# EAGLE design Espress0 (EAGLE 9.1.1)
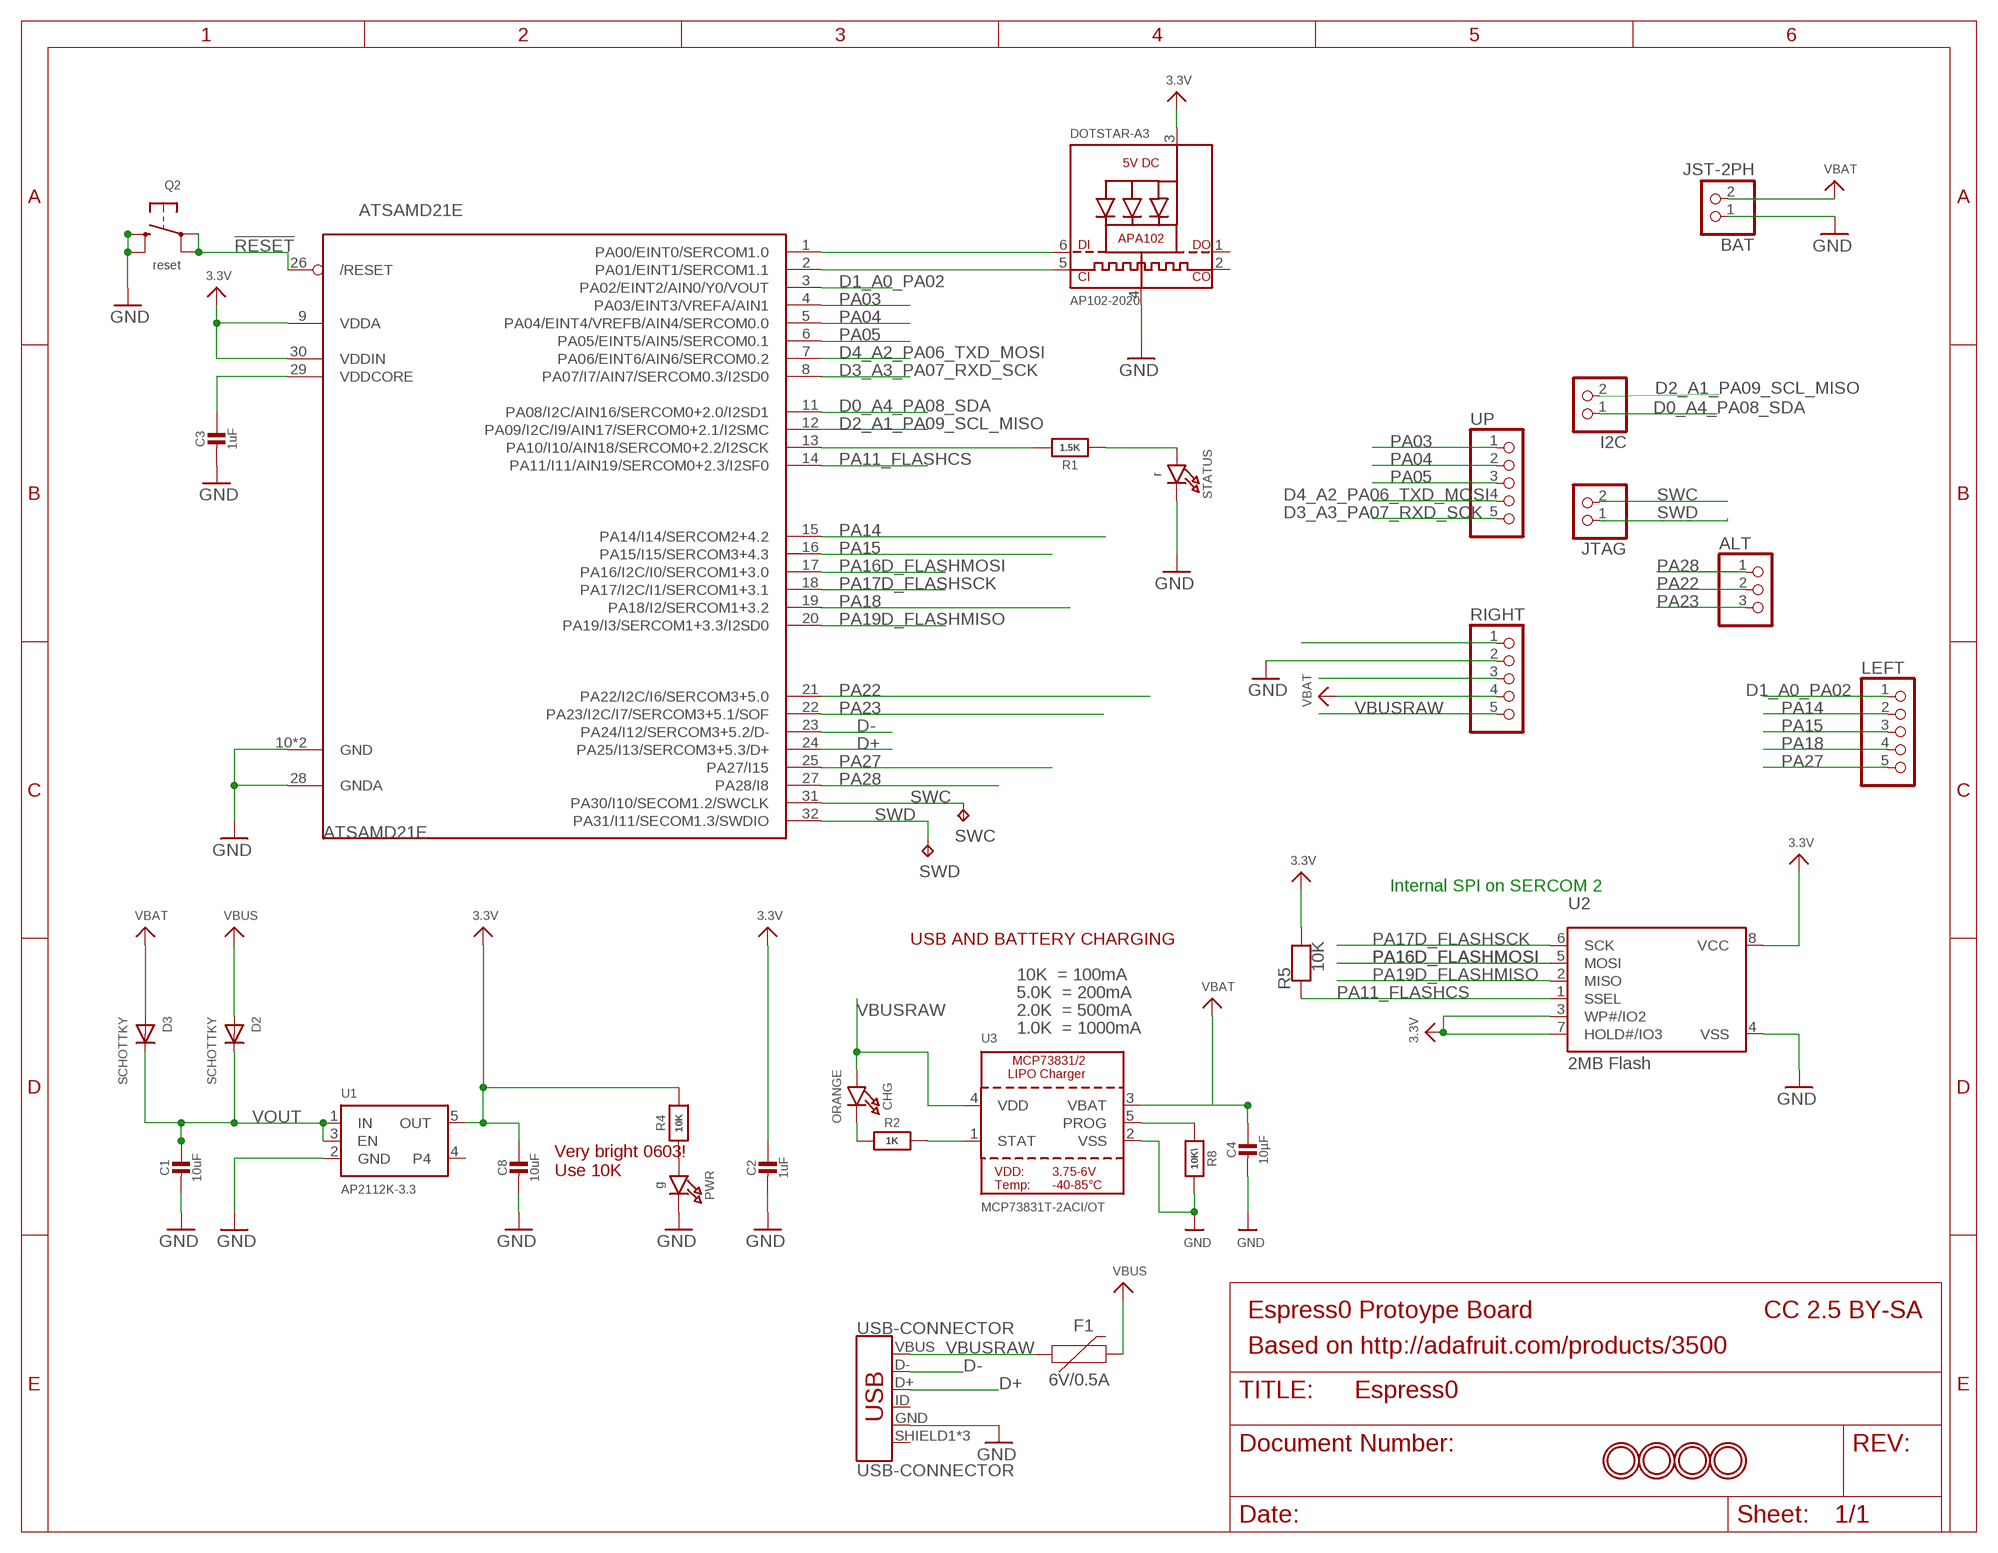
[diagram p0: schematic, sheet 1]

## Parts
ALT  PINHD-1X3CB  [1X03-CLEANBIG]
ATSAMD21E  ATSAMD21E  [QFN32_5MM]
BAT  JST-2PH  CON_JST_PH_2PIN  [JSTPH2]
C1  10uF  CAP_CERAMIC0805-NOOUTLINE  [0805-NO]
C2  1uF  CAP_CERAMIC0603_NO  [0603-NO]
C3  1uF  CAP_CERAMIC0603_NO  [0603-NO]
C4  10µF  CAP_CERAMIC0805-NOOUTLINE  [0805-NO]
C8  10uF  CAP_CERAMIC0805-NOOUTLINE  [0805-NO]
CHG  ORANGE  LED0805_NOOUTLINE  [CHIPLED_0805_NOOUTLINE]
D2  SCHOTTKY  DIODE_SOD-123FL  [SOD-123FL]
D3  SCHOTTKY  DIODE_SOD-123FL  [SOD-123FL]
DOTSTAR-A3  AP102-2020  APA1022020  [APA102_2020]
F1  6V/0.5A  PPTC_HALF-AMP  [1206]
I2C  HEADER-1X2ROUND  [1X02_ROUND]
JTAG  HEADER-1X2ROUND  [1X02_ROUND]
LEFT  HEADER-1X576MIL  [1X05_ROUND_76]
PWR  g  LED0603_NOOUTLINE  [CHIPLED_0603_NOOUTLINE]
Q2  reset  SWITCH_TACT_SMT4.6X2.8  [BTN_KMR2_4.6X2.8]
R1  1.5K  RESISTOR_0603_NOOUT  [0603-NO]
R2  1K  RESISTOR_0603_NOOUT  [0603-NO]
R4  10K  RESISTOR_0603_NOOUT  [0603-NO]
R5  10K  RESISTOR_0603_NOOUT  [0603-NO]
R8  10K\  RESISTOR_0603_NOOUT  [0603-NO]
RIGHT  HEADER-1X576MIL  [1X05_ROUND_76]
STATUS  r  LED0603_NOOUTLINE  [CHIPLED_0603_NOOUTLINE]
SWC  TPB1,27  [B1,27]
SWD  TPB1,27  [B1,27]
U1  AP2112K-3.3  VREG_SOT23-5  [SOT23-5]
U2  2MB Flash  SPIFLASH_SOIC8208MIL  [SOIC8_208MIL]
U3  MCP73831T-2ACI/OT  MCP73831/2  [SOT23-5]
U$8  MOUNTINGHOLE2.0  [MOUNTINGHOLE_2.0_PLATED]
U$9  MOUNTINGHOLE2.0  [MOUNTINGHOLE_2.0_PLATED]
U$13  MOUNTINGHOLE2.0  [MOUNTINGHOLE_2.0_PLATED]
U$14  MOUNTINGHOLE2.0  [MOUNTINGHOLE_2.0_PLATED]
UP  HEADER-1X576MIL  [1X05_ROUND_76]
USB-CONNECTOR  USB-CONNECTOR  USB_MICRO-B_FEMALE-SMT  [USB-B-MICRO-SMD]

## Nets
3.3V: ATSAMD21E.9(VDDA) ATSAMD21E.30(VDDIN) C2.1 C8.1 DOTSTAR-A3.3(VDD) R4.2 R5.2 RIGHT.3 U1.5(OUT) U2.3(WP#/IO2) U2.7(HOLD#/IO3) U2.8(VCC)
!RESET: ATSAMD21E.26(/RESET) Q2.A'(P1) Q2.A(P) RIGHT.1
A3: ATSAMD21E.1(PA00/EINT0/SERCOM1.0) DOTSTAR-A3.6(DI)
D0_A4_PA08_SDA: ATSAMD21E.11(PA08/I2C/AIN16/SERCOM0+2.0/I2SD1) I2C.1
D1_A0_PA02: ATSAMD21E.3(PA02/EINT2/AIN0/Y0/VOUT) LEFT.1
D2_A1_PA09_SCL_MISO: ATSAMD21E.12(PA09/I2C/I9/AIN17/SERCOM0+2.1/I2SMC) I2C.2
D3_A3_PA07_RXD_SCK: ATSAMD21E.8(PA07/I7/AIN7/SERCOM0.3/I2SD0) UP.5
D4_A2_PA06_TXD_MOSI: ATSAMD21E.7(PA06/EINT6/AIN6/SERCOM0.2) UP.4
D+: ATSAMD21E.24(PA25/I13/SERCOM3+5.3/D+) USB-CONNECTOR.D+
D-: ATSAMD21E.23(PA24/I12/SERCOM3+5.2/D-) USB-CONNECTOR.D-
GND: ATSAMD21E.10(GND) ATSAMD21E.28(GNDA) ATSAMD21E.33(GND) BAT.1 C1.2 C2.2 C3.2 C4.2 C8.2 DOTSTAR-A3.4(GND) PWR.C Q2.B'(S1) Q2.B(S) R8.2 RIGHT.2 STATUS.C U1.2(GND) U2.4(VSS) U3.2(VSS) USB-CONNECTOR.GND
N$1: R1.1 STATUS.A
N$2: ATSAMD21E.13(PA10/I10/AIN18/SERCOM0+2.2/I2SCK) R1.2
N$6: PWR.A R4.1
N$8: ATSAMD21E.2(PA01/EINT1/SERCOM1.1) DOTSTAR-A3.5(CKI)
N$11: CHG.C R2.1
N$12: R2.2 U3.1(STAT)
N$13: R8.1 U3.5(PROG)
PA03: ATSAMD21E.4(PA03/EINT3/VREFA/AIN1) UP.1
PA04: ATSAMD21E.5(PA04/EINT4/VREFB/AIN4/SERCOM0.0) UP.2
PA05: ATSAMD21E.6(PA05/EINT5/AIN5/SERCOM0.1) UP.3
PA11_FLASHCS: ATSAMD21E.14(PA11/I11/AIN19/SERCOM0+2.3/I2SF0) R5.1 U2.1(SSEL)
PA14: ATSAMD21E.15(PA14/I14/SERCOM2+4.2) LEFT.2
PA15: ATSAMD21E.16(PA15/I15/SERCOM3+4.3) LEFT.3
PA16D_FLASHMOSI: ATSAMD21E.17(PA16/I2C/I0/SERCOM1+3.0) U2.5(MOSI)
PA17D_FLASHSCK: ATSAMD21E.18(PA17/I2C/I1/SERCOM1+3.1) U2.6(SCK)
PA18: ATSAMD21E.19(PA18/I2/SERCOM1+3.2) LEFT.4
PA19D_FLASHMISO: ATSAMD21E.20(PA19/I3/SERCOM1+3.3/I2SD0) U2.2(MISO)
PA22: ALT.2 ATSAMD21E.21(PA22/I2C/I6/SERCOM3+5.0)
PA23: ALT.3 ATSAMD21E.22(PA23/I2C/I7/SERCOM3+5.1/SOF)
PA27: ATSAMD21E.25(PA27/I15) LEFT.5
PA28: ALT.1 ATSAMD21E.27(PA28/I8)
SWC: ATSAMD21E.31(PA30/I10/SECOM1.2/SWCLK) JTAG.2 SWC.TP
SWD: ATSAMD21E.32(PA31/I11/SECOM1.3/SWDIO) JTAG.1 SWD.TP
VBAT: BAT.2 C4.1 D3.A RIGHT.4 U3.3(VBAT)
VBUS: D2.A F1.2
VBUSRAW: CHG.A F1.1 RIGHT.5 U3.4(VDD) USB-CONNECTOR.VBUS
VDDCORE: ATSAMD21E.29(VDDCORE) C3.1
VOUT: C1.1 D2.C D3.C U1.1(IN) U1.3(EN)
Unconnected: DOTSTAR-A3.1(DO) DOTSTAR-A3.2(CKO) U1.4 USB-CONNECTOR.ID USB-CONNECTOR.SHIELD1(SHIELD) USB-CONNECTOR.SHIELD2(SHIELD) USB-CONNECTOR.SHIELD3(SHIELD)

## Notes on the sheet
- Internal SPI on SERCOM 2
- USB AND BATTERY CHARGING
- 10K  = 100mA
- 5.0K  = 200mA
- 2.0K  = 500mA
- 1.0K  = 1000mA
- Very bright 0603!
  Use 10K
- Espress0 Protoype Board | CC 2.5 BY-SA
- Based on http://adafruit.com/products/3500

## Library data of the parts
ALT = adafruit:PINHD-1X3: PIN HEADER
ATSAMD21E = microbuilder:ATSAMD21E
BAT = microbuilder:CON_JST_PH_2PIN: JST 2-Pin Right-Angle Connector PH-Series - 4UConnector: 17311 SH-Series - 4UConnector: 07278
C1-C4 C8 = microbuilder:CAP_CERAMIC: Ceramic Capacitors For new designs, use the packages preceded by an '_' character since they are more reliable: The following footprints should be used on most boards: _0402 - Standard footprint for regular board layouts _0603 - Standard footprint for regular board layouts _0805 - Standard footprint for regular board layouts _1206 - Standard footprint for regular board layouts For extremely tight-pitch boards where space is at a premium, the following 'micro-pitch' footprints can be used (smaller pads, no silkscreen outline, etc.): _0402MP - Micro-pitch footprint for very dense/compact boards _0603MP - Micro-pitch footprint for very dense/compact boards _0805MP - Micro-pitch footprint for very dense/compact boards _1206MP - Micro-pitch footprint for very dense/compact boards
CHG PWR STATUS = microbuilder:LED: LED 0603 - 0603 Surface Mount Package 2mA: Green LED - Low Power (3.9mcd, 2ma, 1.7Vf) - Digikey: 475-2709-2-ND Orange LED - Low Power (9.8mcd, 2ma, 1.8Vf) - Digikey: 475-1194-2-ND Red LED - Low Power (5mcd, 2ma, 1.8Vf) - Digikey: 475-1195-2-ND Yellow LED - Low Power (7mcd, 2ma, 1.8Vf) - Digikey: 475-1196-2-ND 5mA: Blue LED - Low Power (17mcd, 5ma, 2.9Vf) - Digikey: LNJ937W8CRACT-ND 0805 - 0805 Surface Mount Package 2mA: Red LED (8.8mcd, 2mA, 1.8Vf, Clear) - Low Power [Digikey: 475-2510-1-ND] Green LED (5mcd, 2mA, 1.8Vf, Clear) - Low Power [Digikey: 475-2730-1-ND] Yellow LED (11.3mcd, 2mA, 1.8Vf, Clear) - Low Power [Digikey: 475-2555-1-ND] 20mA: Red LED (104mcd, 20mA, Diffused) - LS R976 [Digikey: 475-1278-6-ND] Red LED (12mcd, 20mA, 2.0Vf, Clear) - APT2012EC [Digikey: 754-1128-1-ND] Green LED (15mcd, 20mA, 2.2Vf, Clear) - APT2012GC [Digikey: 754-1131-1-ND] Orange LED (160mcd, 20mA, 2.1Vf, Clear) - APT2012SECK [Digikey: 754-1130-1-ND] 1206 - 1206 Surface Mount Package Green LED (26mcd, 20mA, Diffused) - LG N971 [Digikey: 475-1407-6-ND] Red LED (15mcd, 20mA, Diffused) - LH N974 [Digikey: 475-1416-6-ND] Cree - Cree High-Power Surface Mount LEDs XPEBWT-L1-0000-00D50 - White 111lm 350mA 2.9Vf 6200K 110° XTEAWT-00-0000-00000LEE3 - White 114lm 350mA 2.85Vf 5000K 115° Everlight - Everlight 45-21 Series Surface Mount LEDs 45-21/QK2C-B2832AC2CB2/2T - Warm White 2000mcd 20mA 3.25Vf 3050K 120° 45-21/LK2C-B38452C4CB2/2T - Nuetral White 2000mcd 20mA 3.25Vf 4150K 120° 45-21/LK2C-B50634C6CB2/2T - Cold White 2200mcd 20mA 3.25Vf 5650K 120° PLCC2 Reverse Mount LS T77K-J1L2-1-0-2-R18-Z - Red 11.25mcd 2mA 1.8Vf 630nm 120° LO T77K-L1M2-24-Z - Orange 19.6mcd 2mA 1.8Vf 606nm 120° LY T77K-K2M1-26-Z - Yellow 15.7mcd 2mA 1.8Vf 587nm 120°
D2 D3 = adafruit:DIODE: Diode SMADIODE - SMA Surface Mount Package 20V 1A Schottky Diode Digikey: 641-1014-6-ND DO-1N4148 - Through Hole Small Current Diode SOD-123 20V 1 A (.5mV Vf) Schottky Diode - Digikey: MBRX120TPMSCT-ND SOD-323 10V 570mA (.38mV Vf, 3ns) Schottky Diode - Digikey: ZLLS410CT-ND SOD-523 30V 30mA Schottky Diode (RB751S-40TE61) - Digikey: RB751S-40TE61CT-ND SOT23-R/W - SOT23 Package (R = Solder Paste/Reflow Ovens, W = Hand-Soldering) BAT54Film 40V 300mA - Digikey: 497-7162-1-ND
DOTSTAR-A3 = microbuilder:APA102: APA102/DotStar Pixels VCC: 5V DC Refresh Rate: 400Hz
F1 = SparkFun-Fuses:PPTC: Resettable Fuse PPTC Resettable Fuse. Really a sort of resistor with a polymeric positive temperature coefficient whose resistance increases dramatically with an increase in temperature. When heated by the power passing through the resistance rises causing the current to be limited, protecting the circuit. This is achieved by the transition of the polymer from a crystalline to an amorphous state where the conductive carbon separates breaking the conductive pathways found in the cool crystalline structure. When a PPTC cools back down it resumes conducting letting the circuit turn back on. SparkFun Products: SparkFun RedBoard - Programmed with Arduino <https://www.sparkfun.com/products/12757> Pro Micro - 5V/16MHz <https://www.sparkfun.com/products/12640> Arduino Pro 328 - 5V/16MHz <https://www.sparkfun.com/products/10915> MP3 Trigger <https://www.sparkfun.com/products/13720>; PROD_ID: RES-08585
I2C JTAG = microbuilder:HEADER-1X2: PIN HEADER
LEFT RIGHT UP = microbuilder:HEADER-1X5: PIN HEADER
Q2 = microbuilder:SWITCH_TACT_SMT: SMT Tact Switches 6x6mm - Digikey: P12940SCT-ND KMR2 (4.6x2.8mm) - Digikey: 401-1426-1-ND EVQ-PQHB55 - Light Touch, 160GF (4.5x4.5mm) - Digikey: P8090SCT-ND KMT0 - KMT021 NGJ LHS (etc.) IP68/Waterproof - Digikey: CKN10289CT-ND
R1 R2 R4 R5 R8 = microbuilder:RESISTOR: Resistors For new designs, use the packages preceded by an '_' character since they are more reliable: The following footprints should be used on most boards: _0402 - Standard footprint for regular board layouts _0603 - Standard footprint for regular board layouts _0805 - Standard footprint for regular board layouts _1206 - Standard footprint for regular board layouts For extremely tight-pitch boards where space is at a premium, the following 'micro-pitch' footprints can be used (smaller pads, no silkscreen outline, etc.): _0402MP - Micro-pitch footprint for very dense/compact boards _0603MP - Micro-pitch footprint for very dense/compact boards _0805MP - Micro-pitch footprint for very dense/compact boards _1206MP - Micro-pitch footprint for very dense/compact boards
SWC SWD = testpad:TP: Test pad
U1 = microbuilder:VREG_SOT23-5: SOT23-5 Fixed Voltage Regulators Part Current Out V Out V In V Dropout θJA (°C/W) TJ (°C) Digikey Part No. ADP121 150mA 3.3V 3.4-5.5V 0.09V @ 150mA -- -- ADP121-AUJZ33R7CT-ND ADP121 150mA 3.0V 3.1-5.5V 0.09V @ 150mA -- -- ADP121-AUJZ30R7CT-ND ADP122 300mA 3.3V 3.4-5.5V 0.085V @ 300mA -- -- ADP122AUJZ-3.3-R7CT-ND ADP1712 300mA 3.3V 3.5-5.5V 0.17V @ 300mA -- -- ADP1712AUJZ-3.3-R7TR-ND AP7311 (Low Cost) 150mA 3.3V 3.5-6V 0.15V @ 150mA -- -- AP7311-33WG-7DICT-ND LD39015M18R 150mA 1.8V 1.9V-5.5V 0.08V @ 100mA -- -- 497-6977-1-ND LP2985A-33DBVR 150mA 3.3V 3.3-16V 0.28V @ 150mA 206 150 296-18479-1-ND MCP1824T-3302E/OT 300mA 3.3V 3.5V-6V 0.2V @ 300mA -- -- MCP1824T-3302E/OTCT-ND MIC5205-2.5YM5 TR 150mA 2.5V 2.7-16V 0.165V @ 150mA -- -- 576-1257-2-ND MIC5205-3.0YM5 TR 150mA 3.0V 3.2V-16V 0.165V @ 150mA -- -- 576-1258-2-ND MIC5205-3.3YM5 TR 150mA 3.3V 3.5V-16V 0.165V @ 150mA -- -- 576-1259-2-ND TPS780330220 150mA 3.3V+2.2V 3.6-5.5V 250mV Max -- -- 296-23332-1-ND TDA3663/N1,135 100mA 3.3V 3.5-45V 0.18V @ 50mA -- -- 568-5343-1-ND Max operating temp can be calculated using θJA, TJ (max junction temperature), and power in watts. Set the "Maximum Ambient Temperature" until it reaches TJ ("Max Junction Temperature"), which is the absolute limit for safe use of the regulator: Heat Sink Temperature Calculator <http://www.daycounter.com/Calculators/Heat-Sink-Temperature-Calculator.phtml> For example, With 12V source into a 3.3V LP2985 and a 30mA load, we are dissipating (12V-3.3V) * 0.03A = 0.261W. With a θJA of 206 °C/W, a TJ of 150°C, and 261mW we can safely use the chip without a heat sink up to 75°C (=147.1°C Junction Temperature).
U2 = microbuilder:SPIFLASH_SOIC8: SOIC8 SPI Flash Be careful with the size since SOIC8 flash comes in several 'widths' SOIC8 150 mil M25P16 - 16Mbit (2Mbit x 8) Serial Flash (75MHz SPI Bus), Supply: 2.7-3.6V Digikey: SOIC8 - M25P16-VMN6P-ND SOIC8 208 mil W25Q16BVSSIG - 16Mbit (2Mbit x 8) Serial Flash (104MHz SPI Bus), Supply: 2.7-3.6V Digikey: SOIC8 - W25Q16BVSSIG-ND
U3 = microbuilder:MCP73831/2: MCP73831/2 LIPO Charger VDD: 3.75 - 6V Temp -40 - 85°C Programmable Charge Rate: 15-500mA NOTE: STAT is a tri-state logic output on the MCP73831 and an open-drain output on the MCP73832. SOT23-5 with 4.2V output and tri-state logic on STAT = MCP73831T-2ACI/OT
U$8 U$9 U$13 U$14 = microbuilder:MOUNTINGHOLE: Mounting Hole For #2 screws (0.086"/2.18mm width, 0.094"/2.4mm hole) use 2.5mm; BOM: EXCLUDE
USB-CONNECTOR = SparkFun-Connectors:USB_MICRO-B: USB Type Micro-B Connector Male/female and PTH/SMT variants SparkFun Products: SparkFun microB USB Breakout <https://www.sparkfun.com/products/12035> SparkFun USB microB Plug Breakout <https://www.sparkfun.com/products/10031> SparkFun ESP8266 Thing <https://www.sparkfun.com/products/13231>; PROD_ID: CONN-11752

## Net classes
1 power: width 0.305 mm

## Board
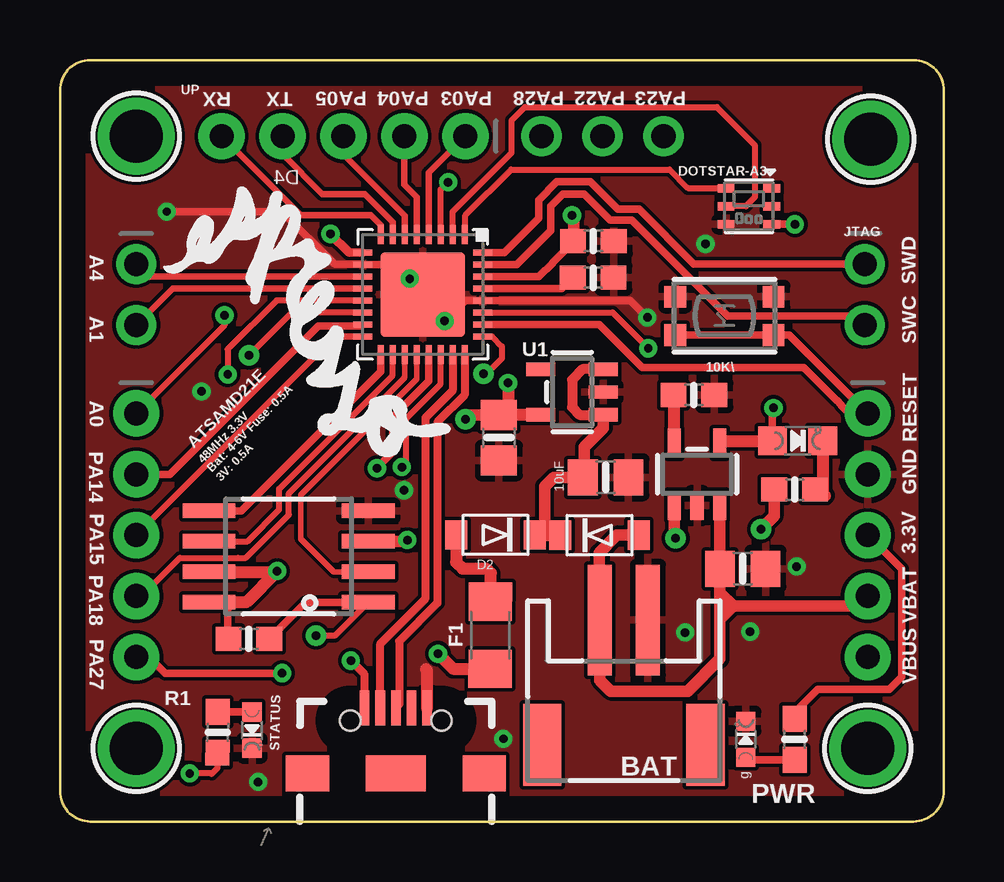
[diagram p1: board, top side]
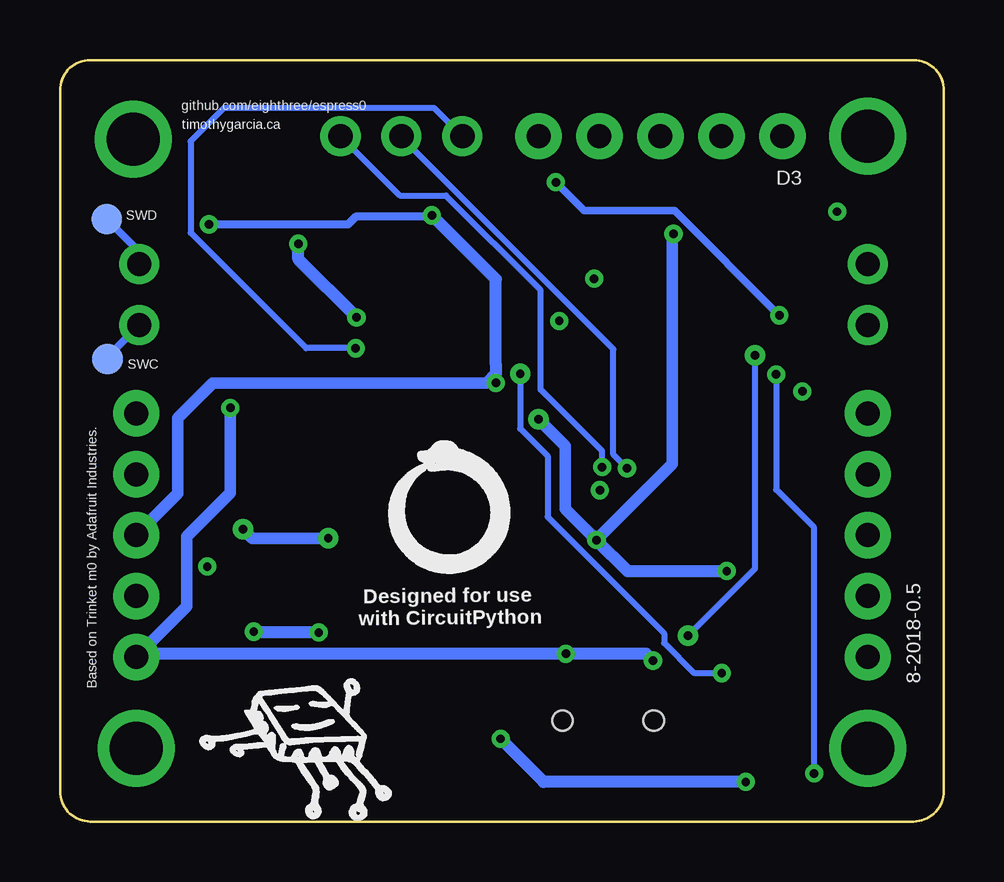
[diagram p2: board, bottom side, seen from below]

Size 36.83 x 31.75 mm. Coordinates in mm from the lower left corner, seen from the top.
Outline: 35.56,0 1.27,0 arc-90 0,1.27 0,30.48 arc-90 1.27,31.75 35.56,31.75 arc-90 36.83,30.48 36.83,1.27 arc-90 35.56,0
Copper layers (1*16): Top 0.035mm / dielectric 1.5mm / Bottom 0.035mm
Design rules "default": minimum track width 6mil, minimum drill 0.35mm, track to track 6mil, track to pad 6mil, pad to pad 6mil, via to via 6mil, smd to smd 6mil, copper to edge 40mil, drill to drill 6mil, minimum pad ring 10mil, minimum via ring 8mil, stop-mask expansion 4mil, vias tented up to drill 0mil, thermal gap 10mil

### Footprints (pad centres in the part's own frame; a part is rotated, then mirrored left to right if it is on the bottom)
1X03-CLEANBIG = drill 1.016 pad 1.676: 1 -2.54,0; 2 0,0; 3 2.54,0
QFN32_5MM = smd 0.8 x 0.25: 1 -2.5,1.75; 2 -2.5,1.25; 3 -2.5,0.75; 4 -2.5,0.25; 5 -2.5,-0.25; 6 -2.5,-0.75; 7 -2.5,-1.25; 8 -2.5,-1.75; 17 2.5,-1.75; 18 2.5,-1.25; 19 2.5,-0.75; 20 2.5,-0.25; 21 2.5,0.25; 22 2.5,0.75; 23 2.5,1.25; 24 2.5,1.75 | smd 0.25 x 0.8: 9 -1.75,-2.5; 10 -1.25,-2.5; 11 -0.75,-2.5; 12 -0.25,-2.5; 13 0.25,-2.5; 14 0.75,-2.5; 15 1.25,-2.5; 16 1.75,-2.5; 25 1.75,2.5; 26 1.25,2.5; 27 0.75,2.5; 28 0.25,2.5; 29 -0.25,2.5; 30 -0.75,2.5; 31 -1.25,2.5; 32 -1.75,2.5 | smd 3.5 x 3.5: 33 0,0
JSTPH2 = smd 1 x 4.6: 1 -1,-3.7; 2 1,-3.7 | smd 1.6 x 3.4: NC1 -3.4,1.5; NC2 3.4,1.5
0805-NO = smd 1.24 x 1.5: 1 -0.95,0; 2 0.95,0
0603-NO = smd 1.075 x 1: 1 -0.85,0; 2 0.85,0
CHIPLED_0805_NOOUTLINE = smd 1.2 x 1.2: A 0,-1.05; C 0,1.05
SOD-123FL = smd 0.91 x 1.22: A 1.637,0; C -1.637,0
APA102_2020 = smd 0.7 x 0.35: 1 -0.95,-0.75; 2 -0.95,0; 3 -0.95,0.75; 4 0.95,0.75; 5 0.95,0; 6 0.95,-0.75
1206 = smd 1.6 x 1.8: 1 -1.4,0; 2 1.4,0
1X02_ROUND = drill 1 pad 1.676: 1 -1.27,0; 2 1.27,0
1X05_ROUND_76 = drill 1 pad 1.93: 1 -5.08,0; 2 -2.54,0; 3 0,0; 4 2.54,0; 5 5.08,0
CHIPLED_0603_NOOUTLINE = smd 0.8 x 0.8: A 0,-0.75; C 0,0.75
BTN_KMR2_4.6X2.8 = smd 0.9 x 0.9: A 2.05,0.8; A' -2.05,0.8; B 2.05,-0.8; B' -2.05,-0.8
B1,27 = smd 1.27 x 1.27: TP 0,0
SOT23-5 = smd 0.55 x 1.2: 1 -0.95,-1.3; 2 0,-1.3; 3 0.95,-1.3; 4 0.95,1.3; 5 -0.95,1.3
SOIC8_208MIL = smd 0.6 x 2.2: 1 -1.905,-3.315; 2 -0.635,-3.315; 3 0.635,-3.315; 4 1.905,-3.315; 5 1.905,3.315; 6 0.635,3.315; 7 -0.635,3.315; 8 -1.905,3.315
MOUNTINGHOLE_2.0_PLATED = drill 2.2 pad 3: P$1 0,0
USB-B-MICRO-SMD = smd 1.45 x 0.4: D+ 2.725,0; D- 2.725,0.65; GND 2.725,-1.3; ID 2.725,-0.65; VBUS 2.725,1.3 | smd 1.5 x 1.8: SHIELD1 0,3.685; SHIELD2 0,-3.685 | smd 1.5 x 2.5: SHIELD3 0,0 | hole 0.85: 2.2,1.9; 2.2,-1.9

### Placement (x,y rotation side)
ALT  22.61,28.57 0 top
ATSAMD21E  15.11,21.97 270 top
BAT  23.5,4.7 180 top
C1  22.73,14.35 0 top
C2  22.23,24.19 0 top
C3  22.21,22.67 0 top
C4  28.45,10.54 0 top
C8  18.29,16 270 top
CHG  30.73,15.88 270 top
D2  18.14,11.95 180 top
D3  22.48,11.94 0 top
DOTSTAR-A3  28.7,25.65 180 top
F1  17.93,7.77 89.7 top
I2C  3.17,21.97 270.1 top
JTAG  33.53,21.97 270 top
LEFT  3.17,11.94 270 top
PWR  28.57,3.43 0 top
Q2  27.69,21.08 180 top
R1  6.57,3.72 269.6 top
R2  30.61,13.84 180 top
R4  30.61,3.43 90 top
R5  7.87,7.62 180 top
R8  26.42,17.78 0 top
RIGHT  33.66,11.94 270 top
STATUS  8,3.81 180 top
SWC  34.85,19.29 0 bottom
SWD  34.88,25.11 0 bottom
U1  21.34,17.91 90 top
U2  9.53,11.05 90 top
U3  26.54,14.48 0 top
U$8  3.17,3.05 0 top
U$9  33.66,3.05 0 top
U$13  33.78,28.45 0 top
U$14  3.17,28.57 0 top
UP  11.81,28.57 180 top
USB-CONNECTOR  14,2.01 90 top

### Tracks (layer width: path | path; a pad name or v marks a point on that pad's centre or on a via)
3.3V  (via drill 0.35, 0.35 pad 0.65, 0.35 pad 0.75, 0.35 pad 0.85)
  Top 0.305: ATSAMD21E.30 19.95,22.72 20.52,23.29 20.52,23.3 21.38,24.15 C2.1 | U2.8 6.99,9.14 6.99,7.66 R5.2 | v30.62,24.9 v30.61,24.9 DOTSTAR-A3.3 | RIGHT.3 35.06,10.53 35.06,6.03 34.55,5.51 31.57,5.51 30.61,4.55 R4.2
  Top 0.356: ATSAMD21E.9 12.05,23.72 v11.27,24.5
  Top 0.483: C8.1 17.08,16.95 v16.89,16.76 | v21.34,25.27 21.4,25.21 C2.1 | v14.48,11.74 14.42,11.68 U2.3
  Top 0.508: U1.5 18.41,16.96 | 18.41,16.96 17.79,16.96 C8.1 | v18.67,18.29 18.67,17.21 18.41,16.96 | U2.8 7.75,9.14 v9.05,10.44 9.02,10.41 U2.7
  Bottom 0.33: v30.62,24.9 24.82,24.9 24.48,25.23 21.38,25.23 v21.34,25.27
  Bottom 0.483: v18.67,18.29 19.05,18.29 30.46,18.29 31.92,16.82 31.92,13.67 RIGHT.3 | v16.89,16.76 15.78,15.65 15.78,13.11 15.78,13.04 v14.48,11.74 11.31,14.9 11.31,24.5 11.3,24.5 v11.27,24.5
  Bottom 0.508: v18.67,18.29 18.67,18.67 | v21.34,25.27 18.67,22.61 18.67,19.05 18.67,18.67 | v14.48,11.74 13.18,10.44 v9.05,10.44 | 18.67,18.67 19.05,18.29
!RESET
  Top 0.305: ATSAMD21E.26 22.46,20.72 24.26,18.92 30.99,18.92 32.37,17.54 32.38,17.54 32.56,17.36 32.56,17.35 32.89,17.02 RIGHT.1 30.39,20.28 Q2.A' Q2.A
A3
  Top 0.254: ATSAMD21E.1 16.89,24.5 16.89,25.27 18.8,27.18 25.4,27.18 26.16,26.42 27.74,26.42 DOTSTAR-A3.6
D0_A4_PA08_SDA
  Top 0.279: ATSAMD21E.11 3.69,22.72 I2C.1
D1_A0_PA02  (via drill 0.35 pad 0.65)
  Top 0.254: ATSAMD21E.3 15.86,26.34 v16.17,26.65 | v6.86,21.1 6.86,20.7 LEFT.1
  Bottom 0.305: v6.86,21.1 11.22,25.46 14.98,25.46 v16.17,26.65
D2_A1_PA09_SCL_MISO
  Top 0.279: ATSAMD21E.12 4.7,22.22 I2C.2
D3_A3_PA07_RXD_SCK
  Top 0.279: ATSAMD21E.8 13.36,24.86 12.95,25.27 10.03,25.27 UP.5
D4_A2_PA06_TXD_MOSI
  Top 0.279: ATSAMD21E.7 13.86,25 12.7,26.16 10.92,26.16 9.27,27.81 UP.4
D+
  Top 0.33: USB-CONNECTOR.D+ 14.13,4.87 14.13,7.51 15.73,9.11 15.73,16.65 16.86,17.79 ATSAMD21E.24
D-
  Top 0.33: ATSAMD21E.23 16.36,17.97 15.24,16.84 15.24,9.3 13.35,7.41 USB-CONNECTOR.D-
GND  (via drill 0.35, 0.35 pad 0.65)
  Top 0.305: v24.47,21.01 23.77,21.72 ATSAMD21E.28 16.88,21.72 v16.03,20.87 16.03,21.06 ATSAMD21E.33 | v4.45,25.43 9.25,25.43 11.44,23.24 12.6,23.24 ATSAMD21E.10 13.98,23.22 v14.57,22.63
  Top 0.508: USB-CONNECTOR.GND 15.29,6.29 15.24,6.35
  Bottom 0.508: v26.05,7.88 28.72,7.88 v28.76,7.92 | v24.47,21.01 26.9,23.44 v26.9,24.09 | v8.26,1.65 16.68,1.65 v18.47,3.45
  other vias: 30.69,10.63 5.9,17.93 14.33,13.81
  pour Top: 0,31.75 36.83,31.75 36.83,0 0,0
N$1
  Top 0.305: R1.1 STATUS.A
N$2  (via drill 0.35)
  Top 0.254: ATSAMD21E.13 9.02,21.72 6.99,19.69 v6.99,18.64 | R1.2 6.56,2.22 6.32,1.99 6.3,2 v5.41,2
  Bottom 0.254: v5.41,2 5.41,12.26 6.1,12.95 6.99,13.84 v6.99,18.64
N$6
  Top 0.305: PWR.A 28.68,2.58 R4.1
N$8
  Top 0.254: ATSAMD21E.2 16.36,25.42 18.82,27.88 18.82,29.23 19.37,29.78 27.37,29.78 28.96,28.19 28.96,26.04 28.57,25.65 DOTSTAR-A3.5
N$11
  Top 0.508: CHG.C 31.78,13.68 | 31.78,13.68 31.88,13.59 | 31.78,13.68 31.62,13.84 R2.1
N$12  (via drill 0.35 pad 0.85)
  Top 0.483: U3.1 25.59,11.87 v25.65,11.81 | R2.2 29.76,12.74 v29.21,12.19
  Bottom 0.483: v25.65,11.81 28.83,11.81 v29.21,12.19
N$13
  Top 0.508: U3.5 25.59,17.75 R8.1
PA03
  Top 0.279: ATSAMD21E.4 15.36,27.05 UP.1
PA04
  Top 0.279: UP.2 14.35,26.54 14.86,26.03 ATSAMD21E.5
PA05
  Top 0.279: ATSAMD21E.6 14.36,25.26 11.81,27.81 UP.3
PA11_FLASHCS  (via drill 0.35 pad 0.85)
  Top 0.254: ATSAMD21E.14 9.66,21.22 v7.87,19.43 | U2.1 11.44,7.75 v10.67,7.75
  Top 0.305: R5.1 10.25,9.14 U2.1
  Bottom 0.254: v7.87,19.43 7.87,10.54 v10.67,7.75
PA14
  Top 0.305: ATSAMD21E.15 12.56,20.67 10.77,20.67 4.58,14.48 LEFT.2
PA15
  Top 0.279: LEFT.3 11.46,20.22 ATSAMD21E.16
PA16D_FLASHMOSI
  Top 0.305: 5.59,12.95 U2.5 7.55,12.95 13.36,18.77 ATSAMD21E.17
PA17D_FLASHSCK
  Top 0.254: U2.6 7.82,11.68 9.13,13 9.13,13.87 13.86,18.6 ATSAMD21E.18
PA18
  Top 0.229: 14.36,18.55 ATSAMD21E.19
  Top 0.254: 7.43,10.99 4.99,10.99 3.4,9.4 LEFT.4 | 7.43,10.99 | 7.43,10.99 7.75,10.99 9.54,12.78 9.54,13.69 14.36,18.51 14.36,18.55
PA19D_FLASHMISO
  Top 0.229: ATSAMD21E.20 14.86,18.45 10.03,13.62 10.03,11.79 11.41,10.41 U2.2
PA22  (via drill 0.35 pad 0.65)
  Top 0.254: ATSAMD21E.21 15.36,18.79
  Top 0.305: ATSAMD21E.21 15.36,18.36 13.88,16.87 13.88,15.4 v13.21,14.73
  Bottom 0.254: v13.21,14.73 13.77,15.29 13.77,19.69 22.61,28.53 ALT.2
PA23  (via drill 0.35 pad 0.65)
  Top 0.254: 15.88,19.46 ATSAMD21E.22 15.86,18.24 14.42,16.8 14.42,14.96 v14.24,14.78
  Bottom 0.254: ALT.3 22.67,26.1 20.75,26.1 16.8,22.15 16.8,18.01 14.24,15.45 v14.24,14.78
PA27  (via drill 0.35, 0.35 pad 0.85)
  Top 0.254: ATSAMD21E.25 18.01,20.22 18.41,19.81 18.41,19.3 17.78,18.67 v17.65,18.67
  Top 0.305: LEFT.5 3.71,6.86 4.39,6.18 9.13,6.18 9.14,6.19 v9.26,6.19
  Bottom 0.254: v17.65,18.67 17.65,16.38 16.51,15.24 16.51,12.7 11.66,7.85 11.66,7.45 10.4,6.19 v9.26,6.19
PA28  (via drill 0.35 pad 0.65)
  Top 0.254: ATSAMD21E.27 23.02,21.22 v24.51,19.73
  Bottom 0.254: ALT.1 21.24,29.75 30,29.75 31.39,28.36 31.39,24.55 26.57,19.73 v24.51,19.73
SWC
  Top 0.305: ATSAMD21E.31 19.03,23.22 20.45,24.64 20.45,25.65 20.95,26.16 21.84,26.16 22.94,25.07 23.83,25.07 27.81,21.08 33.15,21.08 JTAG.2
  Bottom 0.305: JTAG.2 34.85,19.38 SWC.TP
SWD
  Top 0.305: JTAG.1 26.42,23.24 24.13,25.53 23.24,25.53 22.1,26.67 20.7,26.67 19.94,25.91 19.94,25.15 18.51,23.72 ATSAMD21E.32
  Bottom 0.305: SWD.TP 33.53,23.75 JTAG.1
VBAT
  Top 0.483: U3.3 C4.1 27.5,9.54 | BAT.2 22.5,5.89 22.95,5.43 26.15,5.43 27.5,6.78 27.5,8.43 | 27.5,9.54 27.5,8.95 | 27.5,8.95 27.5,8.43 | RIGHT.4 33.24,8.98 28.05,8.98 | 27.5,8.95 27.53,8.98 28.05,8.98 | 27.5,9.54 28.05,8.98 | 28.05,8.98 27.5,8.43 | D3.A 23.2,11.94 22.46,11.21 22.48,11.19 22.48,9.78
  Top 0.508: BAT.2 22.61,8.29 22.61,9.65 22.48,9.78
VBUS
  Top 0.508: D2.A 16.5,10.81 16.77,10.54 17.76,10.54 17.96,10.35 17.93,10.33 F1.2
VBUSRAW  (via drill 0.35, 0.35 pad 0.65)
  Top 0.305: v29.73,17.25 29.68,17.2 CHG.A
  Top 0.33: USB-CONNECTOR.VBUS 12.7,6.13 v12.12,6.71
  Top 0.508: v15.75,6.99 16.38,6.37 F1.1 | U3.4 27.59,15.88 CHG.A
  Bottom 0.483: v29.73,17.25 29.73,13.69 31.54,11.88 31.54,8.97 RIGHT.5
  Bottom 0.508: v12.12,6.71 12.4,6.99 v15.75,6.99 33.52,6.99 RIGHT.5
VDDCORE
  Top 0.305: ATSAMD21E.29 20.91,22.22 C3.1
VOUT
  Top 0.406: U1.3 21.78,18.86 21.34,18.41 21.34,17.27 21.65,16.96 U1.1 | 20.78,11.88 D3.C | 20.19,12.7 20.19,12.43
  Top 0.483: 20.32,11.94 20.19,12.06 20.19,12.7 | 20.19,12.7 20.19,13.97 20.57,14.35 C1.1 21.84,14.41 21.84,15.62 22.64,16.41 U1.1 | 20.19,12.7
  Top 0.508: 20.3,11.94 20.32,11.94 D3.C D2.C

### Text on the board
tPlace: RX | TX | PA05 | PA04 | PA03 | PA28 | PA22 | PA23 | A4 | SWD | A1 | SWC | A0 | RESET | PA14 | GND | PA15 | 3.3V | PA18 | PA27 | VBAT | VBUS
tNames: D4 | 48MHz 3.3V / Bat: 4-6V Fuse: 0.5A / 3V: 0.5A
bNames: github.com/eighthree/espress0 | timothygarcia.ca | 8-2018-0.5 | Designed for use / with CircuitPython | Based on Trinket m0 by Adafruit Industries.
_tsilk: 100 mA
_bsilk: D3